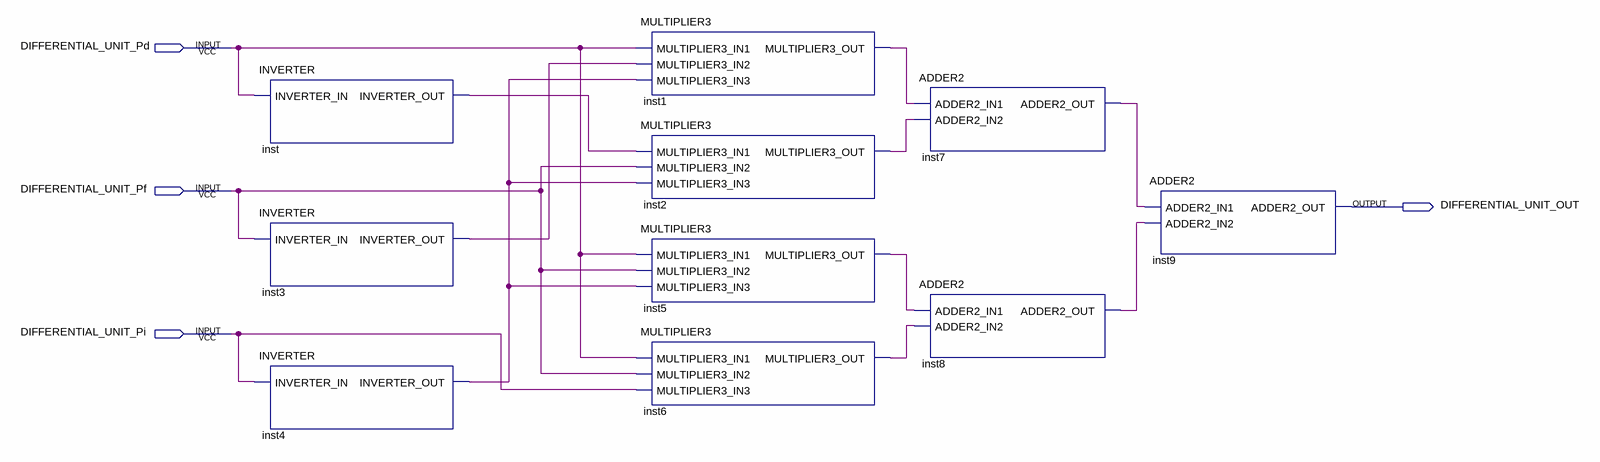
[diagram p0: schematic sheet]
// Quartus schematic DIFFERENTIAL_UNIT.bdf as structural Verilog: 10 symbols, 4 pins
module DIFFERENTIAL_UNIT (
  input  DIFFERENTIAL_UNIT_Pd,
  input  DIFFERENTIAL_UNIT_Pf,
  input  DIFFERENTIAL_UNIT_Pi,
  output DIFFERENTIAL_UNIT_OUT
);

  wire inst1_multiplier3_out, inst2_multiplier3_out, inst3_inverter_out, inst4_inverter_out,
       inst5_multiplier3_out, inst6_multiplier3_out, inst7_adder2_out, inst8_adder2_out, inst_inverter_out;

  INVERTER inst (.INVERTER_IN(DIFFERENTIAL_UNIT_Pd), .INVERTER_OUT(inst_inverter_out));
  INVERTER inst3 (.INVERTER_IN(DIFFERENTIAL_UNIT_Pf), .INVERTER_OUT(inst3_inverter_out));
  INVERTER inst4 (.INVERTER_IN(DIFFERENTIAL_UNIT_Pi), .INVERTER_OUT(inst4_inverter_out));
  MULTIPLIER3 inst1 (
    .MULTIPLIER3_IN1(DIFFERENTIAL_UNIT_Pd), .MULTIPLIER3_IN2(inst3_inverter_out),
    .MULTIPLIER3_IN3(inst4_inverter_out), .MULTIPLIER3_OUT(inst1_multiplier3_out));
  MULTIPLIER3 inst2 (
    .MULTIPLIER3_IN1(inst_inverter_out), .MULTIPLIER3_IN2(DIFFERENTIAL_UNIT_Pf),
    .MULTIPLIER3_IN3(inst4_inverter_out), .MULTIPLIER3_OUT(inst2_multiplier3_out));
  MULTIPLIER3 inst5 (
    .MULTIPLIER3_IN1(DIFFERENTIAL_UNIT_Pd), .MULTIPLIER3_IN2(DIFFERENTIAL_UNIT_Pf),
    .MULTIPLIER3_IN3(inst4_inverter_out), .MULTIPLIER3_OUT(inst5_multiplier3_out));
  MULTIPLIER3 inst6 (
    .MULTIPLIER3_IN1(DIFFERENTIAL_UNIT_Pd), .MULTIPLIER3_IN2(DIFFERENTIAL_UNIT_Pf),
    .MULTIPLIER3_IN3(DIFFERENTIAL_UNIT_Pi), .MULTIPLIER3_OUT(inst6_multiplier3_out));
  ADDER2 inst7 (.ADDER2_IN1(inst1_multiplier3_out), .ADDER2_IN2(inst2_multiplier3_out), .ADDER2_OUT(inst7_adder2_out));
  ADDER2 inst8 (.ADDER2_IN1(inst5_multiplier3_out), .ADDER2_IN2(inst6_multiplier3_out), .ADDER2_OUT(inst8_adder2_out));
  ADDER2 inst9 (.ADDER2_IN1(inst7_adder2_out), .ADDER2_IN2(inst8_adder2_out), .ADDER2_OUT(DIFFERENTIAL_UNIT_OUT));
endmodule
